# Altium schematic sheet sch.SchDoc
size A3
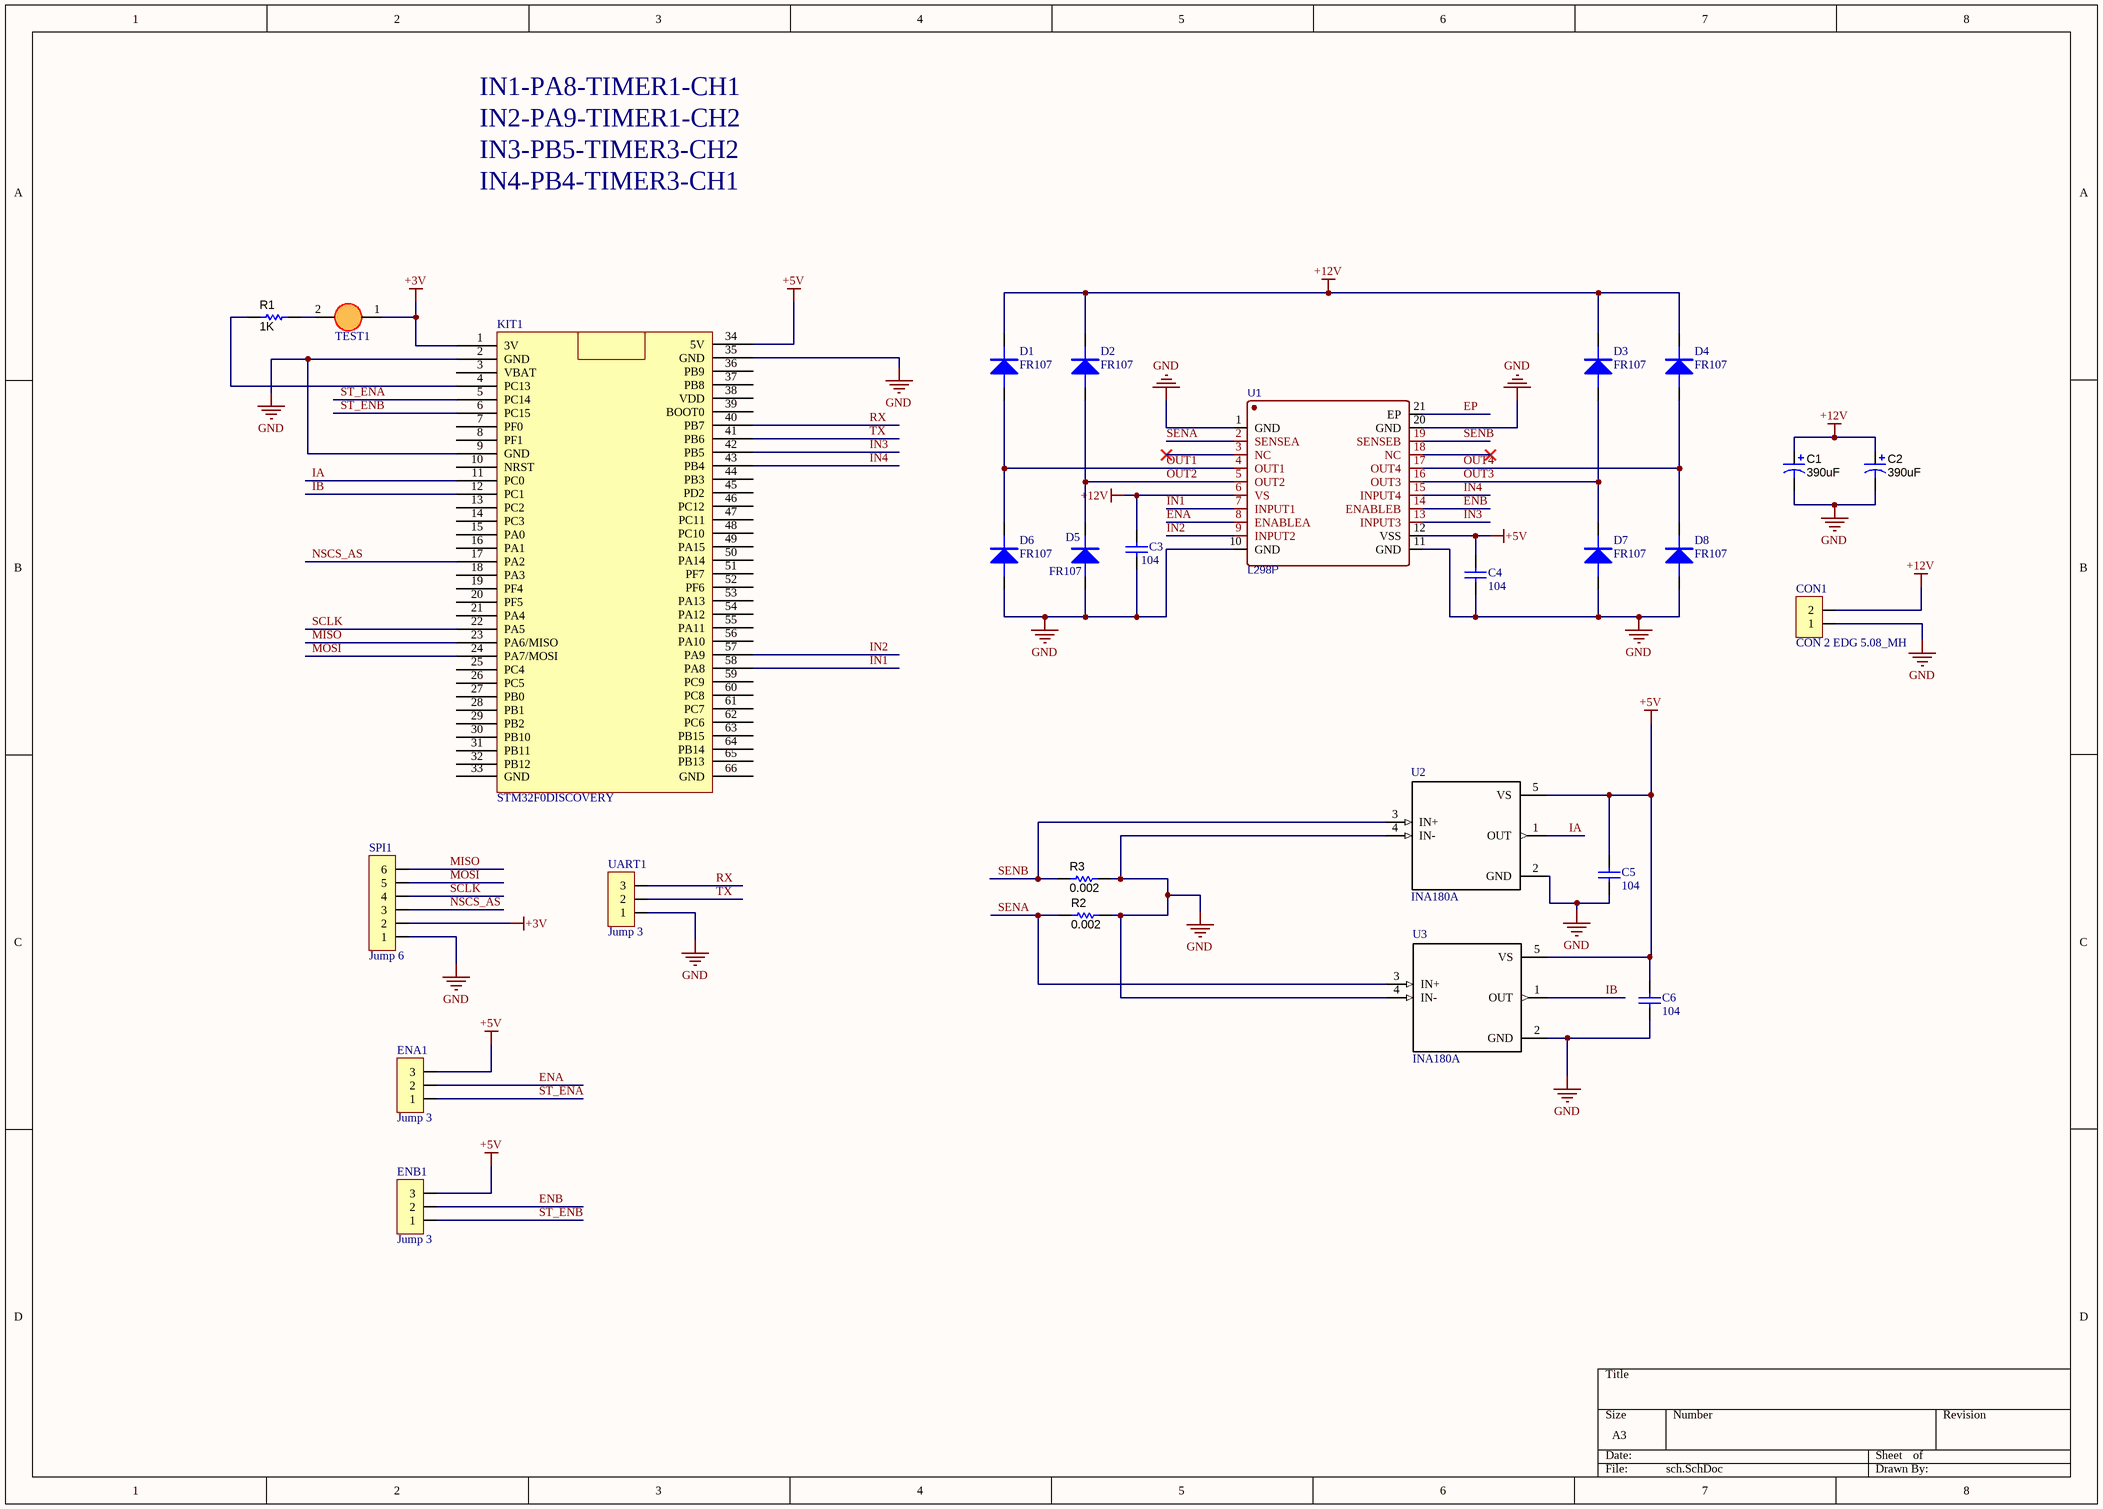
[diagram p0: sch.SchDoc]

## Parts
C1  390uF  [CAP_12.5 X 25]
C2  390uF  [CAP_12.5 X 25]
C3  104  [TU_SMD_0805]
C4  104  [TU_SMD_0805]
C5  104  [TU_SMD_0805]
C6  104  [TU_SMD_0805]
CON1  CON 2 EDG 5.08_MH  [CON 2 EDG 5.08]
D1  FR107  [D2A]
D2  FR107  [D2A]
D3  FR107  [D2A]
D4  FR107  [D2A]
D5  FR107  [D2A]
D6  FR107  [D2A]
D7  FR107  [D2A]
D8  FR107  [D2A]
ENA1  Jump 3  [Jump 3]
ENB1  Jump 3  [Jump 3]
KIT1  STM32F0DISCOVERY  [STM32F0DISCOVERY]
R1  1K  [Tro SMD 0805]
R2  0.002  [2512_R]
R3  0.002  [2512_R]
SPI1  Jump 6  [Jump 6]
TEST1  LED  [LED_0805]  (value not drawn)
U1  L298P  [SOIC127P1420X360-21N]
U2  INA180A  [SOT95P280X145-5N]
U3  INA180A  [SOT95P280X145-5N]
UART1  Jump 3  [Jump 3]

## Nets
+3V: KIT1.1(3V) SPI1.2 TEST1.1(A)
+5V: C4.2 C5.2 C6.2 ENA1.3 ENB1.3 KIT1.34(5V) U1.12(VSS) U2.5(VS) U3.5(VS)
+12V: C1.1(+) C2.1(+) C3.2 CON1.2 D1.2 D2.2 D3.2 D4.2 U1.6(VS)
GND: C1.2(-) C2.2(-) C3.1 C4.1 C5.1 C6.1 CON1.1 D5.1 D6.1 D7.1 D8.1 KIT1.2(GND) KIT1.9(GND) KIT1.35(GND) R2.1 R3.1 SPI1.1 U1.1(GND) U1.10(GND) U1.11(GND) U1.20(GND) U2.2(GND) U2.4(IN-) U3.2(GND) U3.4(IN-) UART1.1
ENA: ENA1.2 U1.8(ENABLEA)
ENB: ENB1.2 U1.14(ENABLEB)
EP: U1.21(EP)
IA: KIT1.11(PC0) U2.1(OUT)
IB: KIT1.12(PC1) U3.1(OUT)
IN1: KIT1.58(PA8) U1.7(INPUT1)
IN2: KIT1.57(PA9) U1.9(INPUT2)
IN3: KIT1.42(PB5) U1.13(INPUT3)
IN4: KIT1.43(PB4) U1.15(INPUT4)
MISO: KIT1.23(PA6/MISO) SPI1.6
MOSI: KIT1.24(PA7/MOSI) SPI1.5
NSCS_AS: KIT1.17(PA2) SPI1.3
OUT1: D1.1 D6.2 U1.4(OUT1)
OUT2: D2.1 D5.2 U1.5(OUT2)
OUT3: D3.1 D7.2 U1.16(OUT3)
OUT4: D4.1 D8.2 U1.17(OUT4)
RX: KIT1.40(PB7) UART1.3
SCLK: KIT1.22(PA5) SPI1.4
SENA: R2.2 U1.2(SENSEA) U3.3(IN+)
SENB: R3.2 U1.19(SENSEB) U2.3(IN+)
ST_ENA: ENA1.1 KIT1.5(PC14)
ST_ENB: ENB1.1 KIT1.6(PC15)
TX: KIT1.41(PB6) UART1.2
NetKIT1_4: KIT1.4(PC13) R1.1
NetR1_2: R1.2 TEST1.2(K)

Not connected (* = marked no-connect by the designer): KIT1 3(VBAT) 7(PF0) 8(PF1) 10(NRST) 13(PC2) 14(PC3) 15(PA0) 16(PA1) 18(PA3) 19(PF4) 20(PF5) 21(PA4) 25(PC4) 26(PC5) 27(PB0) 28(PB1) 29(PB2) 30(PB10) 31(PB11) 32(PB12) 33(GND) 36(PB9) 37(PB8) 38(VDD) 39(BOOT0) 44(PB3) 45(PD2) 46(PC12) 47(PC11) 48(PC10) 49(PA15) 50(PA14) 51(PF7) 52(PF6) 53(PA13) 54(PA12) 55(PA11) 56(PA10) 59(PC9) 60(PC8) 61(PC7) 62(PC6) 63(PB15) 64(PB14) 65(PB13) 66(GND); U1 3(NC)* 18(NC)*

## Notes on the sheet
- IN1-PA8-TIMER1-CH1
- IN2-PA9-TIMER1-CH2
- IN3-PB5-TIMER3-CH2
- IN4-PB4-TIMER3-CH1

## Library data of the parts
C1 C2 = Capacitor TuHoa: CAP ALUM 390UF 20% 50V RADIAL; PartNumber: UHW1H391MPD6; Manufacturer: Nichicon; Polarized: Y; U/M: EA; Cap_F: 0.000390; Tolerance_%: 20; Value1: Unknown; VDC_V: 50; TaMin_C: -40; TaMax_C: 105; Cap_Case: 10x22; AEC Category: Q200; AEC Qualified: N; CompType: Capacitor; SymbolVersion: 2008-07-09; Value: 390uF; PackageReference: 10x22; RoHS: Y; Value2: 50V; MountType: TH; Technology: AL; Series: ZL; Publisher: Texas Instruments; LatestRevisionDate: 2015-12-17; ComponentLink1Description: Datasheet link; ComponentLink1URL: http://nichicon-us.com/english/products/pdfs/e-uhw.pdf; Supplier 1: Digi-Key; Supplier Part Number 1: 493-6885-ND; AEC Grade: N/A; ValueDisplayed: 390uF
C3-C6 = Capacitor 0805: Ceramic Chip Capacitor - Standard; Note: Footprint corresponds to dimensions for bulk cassette packaging. This case size has tightened tolerances.; Published: 17-Jul-2002; LatestRevisionDate: 19-Mar-2004; LatestRevisionNote: Silkscreen size reduced.; DatasheetDocument: Mar-2001; PackageDocument: Mar-2001; PackageReference: 0805; Publisher: Altium Limited; Code_JEITA: 0805; Code_IPC: 2012[0805]; ComponentLink1Description: Manufacturer Link; ComponentLink1URL: http://www.kemet.com/; ComponentLink2Description: Datasheet; ComponentLink2URL: http://www.kemet.com/kemet/web/homepage/kechome.nsf/vapubfilesname/F3102TA.pdf/$file/F3102TA.pdf; Value: 104
CON1 = CON 2 EDG 5.08_MH: CON 2 EDG 5.08 (xanh cong)
D1-D8 = Diode 1N4148 DO35 450mA 100V ( 1N4148 DIP)_MH: Diode 1N4148 DO35 450mA 100V ( 1N4148 DIP)
ENA1 ENB1 UART1 = Jump 3: Jump 3P 2.54
R1-R3 = R nho: RES, 100, 1%, 0.1 W, 0402; PartNumber: ERJ-2RKF1000X; Manufacturer: Panasonic; CompType: Resistor; Res_ohm: 100; Value_Code: 100R; Tolerance_%: 1; Power_W: 0.1; Value2: 0.1W; VDC_V: 50; TempCo: 100 ppm/C; EIA_Code: E96; U/M: EA; AEC Category: Q200; SymbolVersion: 2009-05-29; PackageReference: 0402; RoHS: Y; Value1: 1%; MountType: SMT; Technology: Thick Film; Published: 2008-06-26; Publisher: Texas Instruments; LatestRevisionDate: 2016-01-08; ComponentLink1Description: Datasheet link; ComponentLink1URL: http://industrial.panasonic.com/www-data/pdf/AOA0000/AOA0000CE2.pdf; Supplier 1: Digi-Key; Supplier Part Number 1: P100LCT-ND; Supplier 2: Mouser; Supplier Part Number 2: 667-ERJ-2RKF1000X; Supplier 3: Farnell; Supplier Part Number 3: 2304034; AEC Qualified: ?
  R1: Value: 1K
  R2 R3: Value: 0.002
SPI1 = Jump 6: Jump 6P 2.54
TEST1 = LED SMD_0805_MH: LED 3mm
U1 = L298P: BOM_Manufacturer: STMicroelectronics; spicePre: X; BOM_Supplier Part: C85595; BOM_Supplier: LCSC; BOM_Manufacturer Part: L298P